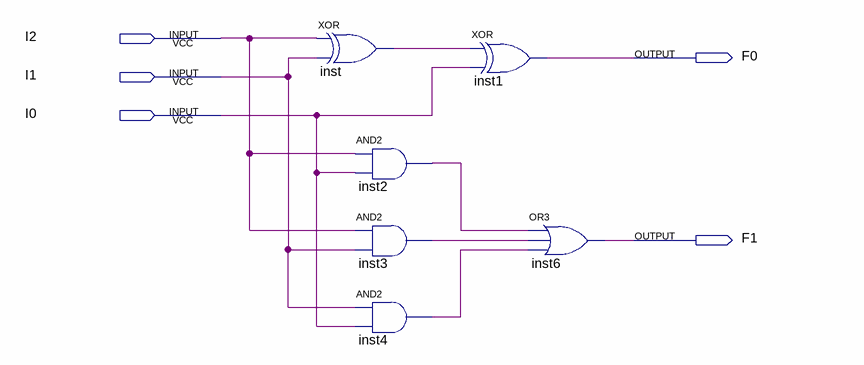
[diagram p0: schematic sheet]
// Quartus schematic Exercise1Question3.bdf as structural Verilog: 6 symbols, 5 pins
module Exercise1Question3 (
  input  I2,
  input  I1,
  input  I0,
  output F0,
  output F1
);

  wire inst2_out, inst3_out, inst4_out, inst_out;

  xor inst (inst_out, I2, I1);
  and inst2 (inst2_out, I2, I0);
  and inst3 (inst3_out, I2, I1);
  and inst4 (inst4_out, I1, I0);
  xor inst1 (F0, inst_out, I0);
  or inst6 (F1, inst2_out, inst3_out, inst4_out);
endmodule
